# EAGLE design MicroVersion (EAGLE 6.5.0)
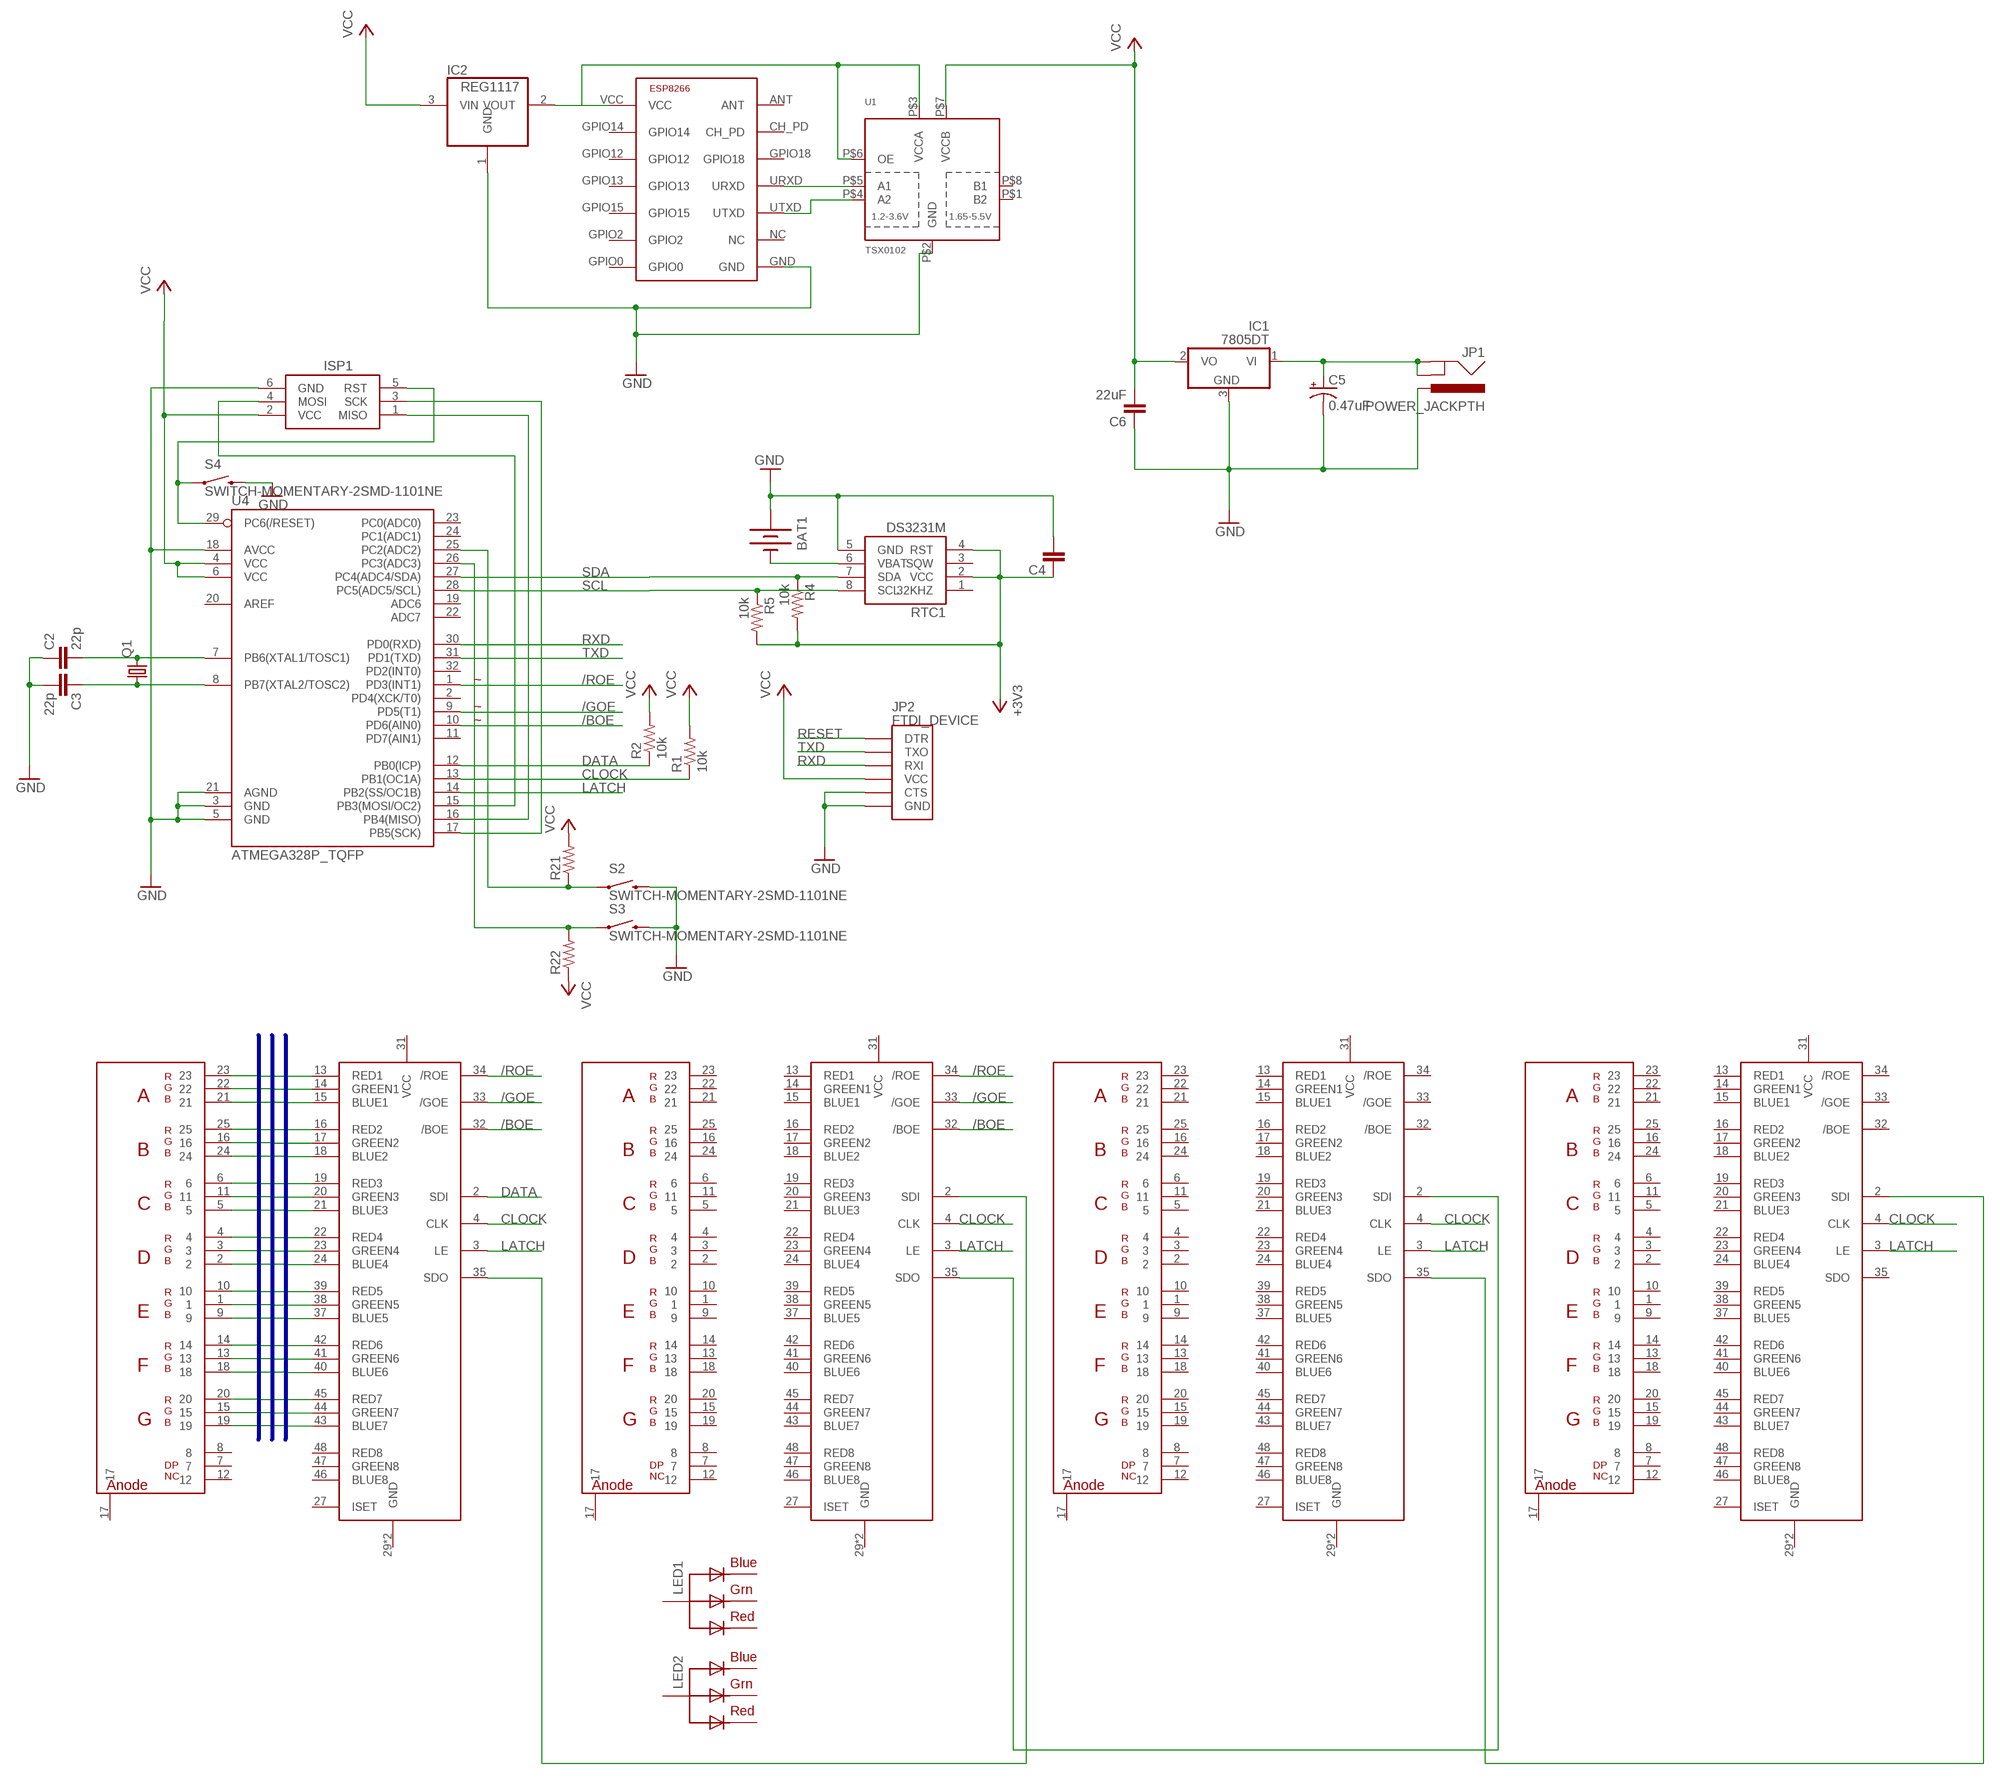
[diagram p0: schematic, sheet 1]

## Parts
BAT1  BATTERY12MM  [BATTCON_12MM]
C2  22p  CAP0805  [0805]
C3  22p  CAP0805  [0805]
C4  CAP0805  [0805]
C5  0.47uF  10UF-16V-10%(TANT)  [EIA3216]
C6  22uF  22UF-16V-20%-(1210)  [1210]
IC1  7805DT  [TO252]
IC2  REG1117  [SOT223]
ISP1  AVRISP-6  [AVRISP]
JP1  POWER_JACKPTH  [POWER_JACK_PTH]
JP2  FTDI_DEVICE  [FTDI_DEVICE_SIDE]
LED1  RGBLED_CA-5MM  [LED5MMRGB]
LED2  RGBLED_CA-5MM  [LED5MMRGB]
Q1  CRYSTALCTS406  [CTS406]
R1  10k  RESISTOR0805-RES  [0805]
R2  10k  RESISTOR0805-RES  [0805]
R4  10k  RESISTOR0805-RES  [0805]
R5  10k  RESISTOR0805-RES  [0805]
R21  RESISTOR0805-RES  [0805]
R22  RESISTOR0805-RES  [0805]
RTC1  DS3231M  [SOIC8]
S2  SWITCH-MOMENTARY-2SMD-1101NE  [TACTILE-SWITCH-1101NE]
S3  SWITCH-MOMENTARY-2SMD-1101NE  [TACTILE-SWITCH-1101NE]
S4  SWITCH-MOMENTARY-2SMD-1101NE  [TACTILE-SWITCH-1101NE]
U1  TSX0102  TXS0102  [VFSOP-8]
U4  ATMEGA328P_TQFP  [TQFP32-08]
U$1  RGBSEVENSEGMENT  [RGBSEVENSEGMENT]
U$2  RGBSEVENSEGMENT  [RGBSEVENSEGMENT]
U$3  RGBSEVENSEGMENT  [RGBSEVENSEGMENT]
U$4  RGBSEVENSEGMENT  [RGBSEVENSEGMENT]
U$5  LED2472G  [TQFP48]
U$6  LED2472G  [TQFP48]
U$7  LED2472G  [TQFP48]
U$8  LED2472G  [TQFP48]
U$10  ESP8266-03  [ESP-03]

## Nets
1BLUE1: U$1.24 U$5.15(BLUE1)
1BLUE2: U$1.21 U$5.18(BLUE2)
1BLUE3: U$1.19 U$5.21(BLUE3)
1BLUE4: U$1.18 U$5.24(BLUE4)
1BLUE5: U$1.9 U$5.37(BLUE5)
1BLUE6: U$1.2 U$5.40(BLUE6)
1BLUE7: U$1.5 U$5.43(BLUE7)
1GREEN1: U$1.16 U$5.14(GREEN1)
1GREEN2: U$1.22 U$5.17(GREEN2)
1GREEN3: U$1.15 U$5.20(GREEN3)
1GREEN4: U$1.13 U$5.23(GREEN4)
1GREEN5: U$1.1 U$5.38(GREEN5)
1GREEN6: U$1.3 U$5.41(GREEN6)
1GREEN7: U$1.11 U$5.44(GREEN7)
1RED1: U$1.25 U$5.13(RED1)
1RED2: U$1.23 U$5.16(RED2)
1RED3: U$1.20 U$5.19(RED3)
1RED4: U$1.14 U$5.22(RED4)
1RED5: U$1.10 U$5.39(RED5)
1RED6: U$1.4 U$5.42(RED6)
1RED7: U$1.6 U$5.45(RED7)
/BOE: U4.10(PD6(AIN0)) U$5.32(/BOE) U$6.32(/BOE)
/GOE: U4.9(PD5(T1)) U$5.33(/GOE) U$6.33(/GOE)
/ROE: U4.1(PD3(INT1)) U$5.34(/ROE) U$6.34(/ROE)
CLOCK: R1.1 U4.13(PB1(OC1A)) U$5.4(CLK) U$6.4(CLK) U$7.4(CLK) U$8.4(CLK)
DATA: R2.1 U4.12(PB0(ICP)) U$5.2(SDI)
GND: BAT1.PWR@1(+) C2.1 C3.2 C4.2 C5.C(-) C6.1 IC1.3(GND) IC2.1(GND) ISP1.6(GND) JP1.PWR JP2.P$5(CTS) JP2.P$6(GND) RTC1.5(GND) S2.2 S3.2 S4.2 U1.P$2(GND) U4.3(GND) U4.5(GND) U4.18(AVCC) U4.21(AGND) U$10.GND
LATCH: U4.14(PB2(SS/OC1B)) U$5.3(LE) U$6.3(LE) U$7.3(LE) U$8.3(LE)
MISO: ISP1.1(MISO) U4.16(PB4(MISO))
MOSI: ISP1.4(MOSI) U4.15(PB3(MOSI/OC2))
N$1: BAT1.GND(-) RTC1.6(VBAT)
N$2: U$5.35(SDO) U$6.2(SDI)
N$3: U$6.35(SDO) U$7.2(SDI)
N$4: U$7.35(SDO) U$8.2(SDI)
N$5: C5.A(+) IC1.1(VI) JP1.GND JP1.GNDBREAK
N$7: R22.2 S3.1 U4.26(PC3(ADC3))
N$8: R21.1 S2.1 U4.25(PC2(ADC2))
N$9: IC2.2(VOUT) U1.P$3(VCCA) U1.P$6(OE) U$10.VCC
N$11: U1.P$5(A1) U$10.URXD
N$12: U1.P$4(A2) U$10.UTXD
RESET: ISP1.5(RST) JP2.P$1(DTR) S4.1 U4.29(PC6(/RESET))
RXD: JP2.P$3(RXI) U4.30(PD0(RXD))
SCK: ISP1.3(SCK) U4.17(PB5(SCK))
SCL: R5.1 RTC1.8(SCL) U4.28(PC5(ADC5/SCL))
SDA: R4.1 RTC1.7(SDA) U4.27(PC4(ADC4/SDA))
TXD: JP2.P$2(TXO) U4.31(PD1(TXD))
VCC: C4.1 C6.2 IC1.2(VO) IC2.3(VIN) ISP1.2(VCC) JP2.P$4(VCC) R1.2 R2.2 R4.2 R5.2 R21.2 R22.1 RTC1.2(VCC) RTC1.4(RST) U1.P$7(VCCB) U4.4(VCC) U4.6(VCC) ; supply symbol labelled +3V3
XTAL1: C2.2 Q1.3 U4.7(PB6(XTAL1/TOSC1))
XTAL2: C3.1 Q1.1 U4.8(PB7(XTAL2/TOSC2))
Unconnected: LED1.1(RED) LED1.2(VCC) LED1.3(GREEN) LED1.4(BLUE) LED2.1(RED) LED2.2(VCC) LED2.3(GREEN) LED2.4(BLUE) RTC1.1(32KHZ) RTC1.3(SQW) U1.P$1(B2) U1.P$8(B1) U4.2(PD4(XCK/T0)) U4.11(PD7(AIN1)) U4.19(ADC6) U4.20(AREF) U4.22(ADC7) U4.23(PC0(ADC0)) U4.24(PC1(ADC1)) U4.32(PD2(INT0)) U$1.7 U$1.8 U$1.12 U$1.17 U$2.1 U$2.2 U$2.3 U$2.4 U$2.5 U$2.6 U$2.7 U$2.8 U$2.9 U$2.10 U$2.11 U$2.12 U$2.13 U$2.14 U$2.15 U$2.16 U$2.17 U$2.18 U$2.19 U$2.20 U$2.21 U$2.22 U$2.23 U$2.24 U$2.25 U$3.1 U$3.2 U$3.3 U$3.4 U$3.5 U$3.6 U$3.7 U$3.8 U$3.9 U$3.10 U$3.11 U$3.12 U$3.13 U$3.14 U$3.15 U$3.16 U$3.17 U$3.18 U$3.19 U$3.20 U$3.21 U$3.22 U$3.23 U$3.24 U$3.25 U$4.1 U$4.2 U$4.3 U$4.4 U$4.5 U$4.6 U$4.7 U$4.8 U$4.9 U$4.10 U$4.11 U$4.12 U$4.13 U$4.14 U$4.15 U$4.16 U$4.17 U$4.18 U$4.19 U$4.20 U$4.21 U$4.22 U$4.23 U$4.24 U$4.25 U$5.27(ISET) U$5.29(GND) U$5.30(GND) U$5.31(VCC) U$5.46(BLUE8) U$5.47(GREEN8) U$5.48(RED8) U$6.13(RED1) U$6.14(GREEN1) U$6.15(BLUE1) U$6.16(RED2) U$6.17(GREEN2) U$6.18(BLUE2) U$6.19(RED3) U$6.20(GREEN3) U$6.21(BLUE3) U$6.22(RED4) U$6.23(GREEN4) U$6.24(BLUE4) U$6.27(ISET) U$6.29(GND) U$6.30(GND) U$6.31(VCC) U$6.37(BLUE5) U$6.38(GREEN5) U$6.39(RED5) U$6.40(BLUE6) U$6.41(GREEN6) U$6.42(RED6) U$6.43(BLUE7) U$6.44(GREEN7) U$6.45(RED7) U$6.46(BLUE8) U$6.47(GREEN8) U$6.48(RED8) U$7.13(RED1) U$7.14(GREEN1) U$7.15(BLUE1) U$7.16(RED2) U$7.17(GREEN2) U$7.18(BLUE2) U$7.19(RED3) U$7.20(GREEN3) U$7.21(BLUE3) U$7.22(RED4) U$7.23(GREEN4) U$7.24(BLUE4) U$7.27(ISET) U$7.29(GND) U$7.30(GND) U$7.31(VCC) U$7.32(/BOE) U$7.33(/GOE) U$7.34(/ROE) U$7.37(BLUE5) U$7.38(GREEN5) U$7.39(RED5) U$7.40(BLUE6) U$7.41(GREEN6) U$7.42(RED6) U$7.43(BLUE7) U$7.44(GREEN7) U$7.45(RED7) U$7.46(BLUE8) U$7.47(GREEN8) U$7.48(RED8) U$8.13(RED1) U$8.14(GREEN1) U$8.15(BLUE1) U$8.16(RED2) U$8.17(GREEN2) U$8.18(BLUE2) U$8.19(RED3) U$8.20(GREEN3) U$8.21(BLUE3) U$8.22(RED4) U$8.23(GREEN4) U$8.24(BLUE4) U$8.27(ISET) U$8.29(GND) U$8.30(GND) U$8.31(VCC) U$8.32(/BOE) U$8.33(/GOE) U$8.34(/ROE) U$8.35(SDO) U$8.37(BLUE5) U$8.38(GREEN5) U$8.39(RED5) U$8.40(BLUE6) U$8.41(GREEN6) U$8.42(RED6) U$8.43(BLUE7) U$8.44(GREEN7) U$8.45(RED7) U$8.46(BLUE8) U$8.47(GREEN8) U$8.48(RED8) U$10.ANT U$10.CH_PD U$10.GPIO0 U$10.GPIO2 U$10.GPIO12 U$10.GPIO13 U$10.GPIO14 U$10.GPIO15 U$10.GPIO18 U$10.NC

## Buses
1RED[1..7]
1GREEN[1..7]
1BLUE[1..7]

## Notes on the sheet
- ~
- ~
- ~

## Library data of the parts
BAT1 = SparkFun-Electromechanical:BATTERY: Battery Holders Various common sizes : AA, AAA, 18650 (PRT-12895), 20mm coin cell and 12mm coin cell. 20MM_4LEGS, BATT-10373; PROD_ID: BATT-08044
C2-C4 = SparkFun-Passives:CAP: Capacitor Standard 0603 ceramic capacitor, and 0.1" leaded capacitor.
C5 = SparkFun-Capacitors:10UF-16V-10%(TANT): CAP-00811 1206/EIA-3216 Tantalum capacitor; PROD_ID: CAP-00811; VALUE: 10uF
C6 = SparkFun-Capacitors:22UF-16V-20%-(1210): CAP-10381; PROD_ID: CAP-10381
IC1 = linear:78*: Positive VOLTAGE REGULATOR Source: http://cache.national.com/ds/LM/LM78L05.pdf http://www.fairchildsemi.com/ds/LM/LM7805.pdf
IC2 = burr-brown:REG1117: 800mA and 1A Low Dropout (LDO) Positive Regulator 1.8V, 2.5V, 2.85V, 3.3V, 5V, and Adj; MPN: REG1117; OC_FARNELL: 1097566; OC_NEWARK: 14P6981
ISP1 = adafruit:AVRISP: AVR ISP HEADER Standard 6 pin header for AVR programming
JP1 = SparkFun-Connectors:POWER_JACK: Power Jack This is the standard 5.5mm barrel jack for power. The PTH is the most common, proven, reliable, footprint. The Slot footprint only works if the mill layer is transmitted to the PCB fab house so be warned. Mating wall wart : TOL-00298 (and others); PROD_ID: CONN-08197
JP2 = SparkFun-Connectors:FTDI_DEVICE: Connector which mates to FTDI basic or FTDI cable.
LED1 LED2 = adafruit:RGBLED_CA: RGB LED, common-anode 5MM Staggered pins 5mm Piranha package http://www.ladyada.net/library/pcb/eaglelibrary.html
Q1 = adafruit:CRYSTAL: CRYSTAL; OC_FARNELL: unknown; OC_NEWARK: unknown
R1 R2 R4 R5 R21 R22 = SparkFun-Passives:RESISTOR: Resistor Basic schematic elements and footprints for 0603, 1206, and PTH resistors.
RTC1 = SparkFun-DigitalIC:DS3231M: DS3231M Real Time Clock. Accuracy +/-5ppm. Battery Backup. 2.3V to 5.5V.; PROD_ID: IC-11985
S2-S4 = SparkFun-Electromechanical:SWITCH-MOMENTARY-2: Various NO switches- pushbuttons, reed, etc; PROD_ID: SWCH-00815
U1 = adafruit:TXS0102: 2-Bit Bi-Directional Level Shifter (I2C, etc.) Designed for I2C devices and has internal pullups. Not to be confused with TXB010x series. 1.2V-3.6V (VCCA) to 1.65V-5.5V (VCCB) bi-directional level shifter with auto direction sensing. Max data rate - 24Mbps (Push Pull), 2Mbps (Open Drain) Digikey: 296-21931-1-ND
U4 = SparkFun-DigitalIC:ATMEGA328P_TQFP; PROD_ID: IC-09069
U$1-U$4 = Benchoff:RGBSEVENSEGMENT
U$5-U$8 = Benchoff:LED2472G
U$10 = #ESP8266:ESP8266-03: ESP8266 - ESP-03 Module

## Board
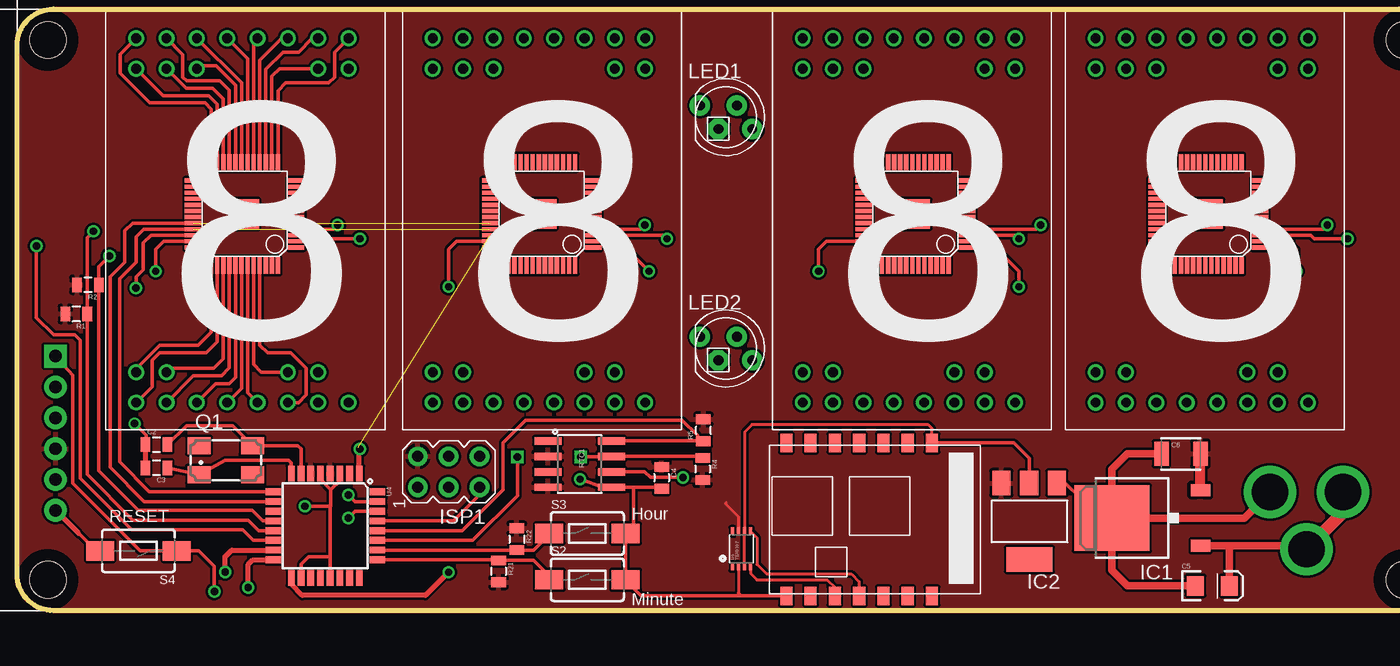
[diagram p1: board, top side]
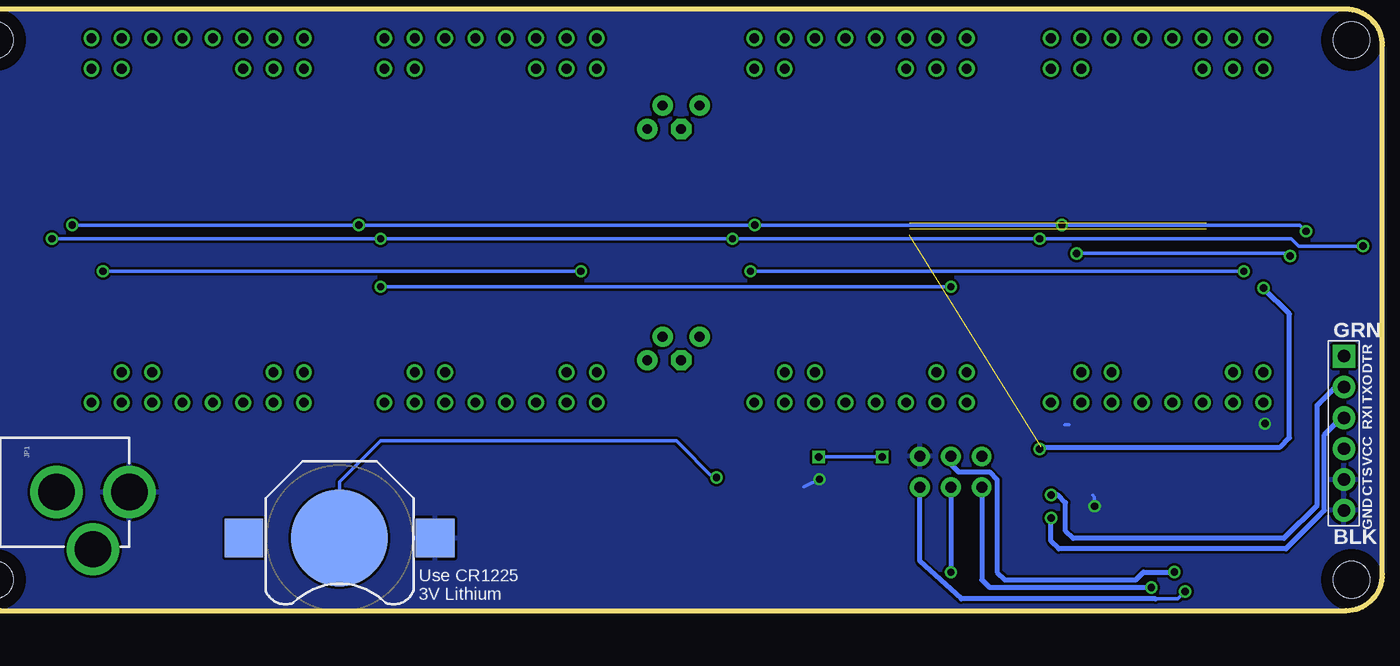
[diagram p2: board, bottom side, seen from below]

No outline drawn. Coordinates in mm, seen from the top.
Copper layers (1*16): Top 0.035mm / dielectric 1.5mm / Bottom 0.035mm
Design rules "default": minimum track width 10mil, minimum drill 24mil, track to track 8mil, track to pad 8mil, pad to pad 8mil, via to via 8mil, smd to smd 8mil, copper to edge 40mil, drill to drill 8mil, minimum pad ring 10mil, minimum via ring 8mil, stop-mask expansion 4mil, vias tented up to drill 0mil, thermal gap 10mil
Holes 3 mm at 36.83,10.16 148.59,10.16 36.83,54.61 148.59,54.61
tRestrict: area 130.8,16.9 to 132.7,19.4
Milling: 8 lines

### Footprints (pad centres in the part's own frame; a part is rotated, then mirrored left to right if it is on the bottom)
BATTCON_12MM = smd 8 x 8: GND 0,0 | smd 3.175 x 3.175: PWR@1 -7.874,0; PWR@2 7.874,0
0805 = smd 0.8 x 1.2: 1 -0.9,0; 2 0.9,0
EIA3216 = smd 1.4 x 1.6: A 1.4,0; C -1.4,0
1210 = smd 1.2 x 2: 1 -1.6,0; 2 1.6,0
TO252 = smd 1 x 1.6: 1 -2.28,-4.8; 2 2.28,-4.8 | smd 5.4 x 6.2: 3 0,2.5
SOT223 = smd 1.499 x 2.007: 1 -2.261,-3.15; 2 0.025,-3.15; 3 2.311,-3.15 | smd 3.81 x 2.007: 4 0,3.15
AVRISP = drill 0.9 pad 1.626: 1 -1.27,2.54; 2 1.27,2.54; 3 -1.27,0; 4 1.27,0; 5 -1.27,-2.54; 6 1.27,-2.54
POWER_JACK_PTH = drill 2.997 pad 4.318: GND 0,7.7; GNDBREAK 4.7,10.7; PWR 0,13.7
FTDI_DEVICE_SIDE = drill 1.016 pad 1.88 square: P$1 -6.35,0 | drill 1.016 pad 1.88: P$2 -3.81,0; P$3 -1.27,0; P$4 1.27,0; P$5 3.81,0; P$6 6.35,0
LED5MMRGB = drill 0.8 pad 1.676: 1 -2.159,0.968; 3 0.889,0.968; 4 2.159,-0.968 | drill 0.8 pad 1.676 octagon: 2 -0.635,-0.968
CTS406 = smd 1.9 x 1.4: 1 -2.2,-1.2; 2 2.2,-1.2; 3 2.2,1.2; 4 -2.2,1.2
SOIC8 = smd 0.61 x 2.21: 1 -1.905,-2.616; 2 -0.635,-2.616; 3 0.635,-2.616; 4 1.905,-2.616; 5 1.905,2.616; 6 0.635,2.616; 7 -0.635,2.616; 8 -1.905,2.616
TACTILE-SWITCH-1101NE = smd 2.3 x 1.6: 1 -3.15,0; 2 3.15,0
VFSOP-8 = smd 0.25 x 0.65: P$1 -0.75,-1.45; P$2 -0.25,-1.45; P$3 0.25,-1.45; P$4 0.75,-1.45; P$5 0.75,1.45; P$6 0.25,1.45; P$7 -0.25,1.45; P$8 -0.75,1.45
TQFP32-08 = smd 1.27 x 0.559: 1 -4.293,2.8; 2 -4.293,2; 3 -4.293,1.2; 4 -4.293,0.4; 5 -4.293,-0.4; 6 -4.293,-1.2; 7 -4.293,-2; 8 -4.293,-2.8; 17 4.293,-2.8; 18 4.293,-2; 19 4.293,-1.2; 20 4.293,-0.4; 21 4.293,0.4; 22 4.293,1.2; 23 4.293,2; 24 4.293,2.8 | smd 0.559 x 1.27: 9 -2.8,-4.293; 10 -2,-4.293; 11 -1.2,-4.293; 12 -0.4,-4.293; 13 0.4,-4.293; 14 1.2,-4.293; 15 2,-4.293; 16 2.8,-4.293; 25 2.8,4.293; 26 2,4.293; 27 1.2,4.293; 28 0.4,4.293; 29 -0.4,4.293; 30 -1.2,4.293; 31 -2,4.293; 32 -2.8,4.293
RGBSEVENSEGMENT = drill 0.8: 1 2.5,2.25; 2 5,2.25; 3 7.5,2.25; 4 10,2.25; 5 12.5,2.25; 6 15,2.25; 7 17.5,2.25; 8 20,2.25; 9 2.5,4.75; 10 5,4.75; 11 15,4.75; 12 17.5,4.75; 13 2.5,29.75; 14 5,29.75; 15 7.5,29.75; 16 17.5,29.75; 17 20,29.75; 18 2.5,32.25; 19 5,32.25; 20 7.5,32.25; 21 10,32.25; 22 12.5,32.25; 23 15,32.25; 24 17.5,32.25; 25 20,32.25
TQFP48 = smd 0.35 x 1.35: 1 -2.75,-4.25; 2 -2.25,-4.25; 3 -1.75,-4.25; 4 -1.25,-4.25; 5 -0.75,-4.25; 6 -0.25,-4.25; 7 0.25,-4.25; 8 0.75,-4.25; 9 1.25,-4.25; 10 1.75,-4.25; 11 2.25,-4.25; 12 2.75,-4.25; 25 2.75,4.25; 26 2.25,4.25; 27 1.75,4.25; 28 1.25,4.25; 29 0.75,4.25; 30 0.25,4.25; 31 -0.25,4.25; 32 -0.75,4.25; 33 -1.25,4.25; 34 -1.75,4.25; 35 -2.25,4.25; 36 -2.75,4.25 | smd 1.35 x 0.35: 13 4.25,-2.75; 14 4.25,-2.25; 15 4.25,-1.75; 16 4.25,-1.25; 17 4.25,-0.75; 18 4.25,-0.25; 19 4.25,0.25; 20 4.25,0.75; 21 4.25,1.25; 22 4.25,1.75; 23 4.25,2.25; 24 4.25,2.75; 37 -4.25,2.75; 38 -4.25,2.25; 39 -4.25,1.75; 40 -4.25,1.25; 41 -4.25,0.75; 42 -4.25,0.25; 43 -4.25,-0.25; 44 -4.25,-0.75; 45 -4.25,-1.25; 46 -4.25,-1.75; 47 -4.25,-2.25; 48 -4.25,-2.75 | smd 2.4 x 2.4: PAD 0,0
ESP-03 = smd 1 x 1.5: ANT 4,12.4; CH_PD 6,12.4; GND 16,12.4; GPIO0 16,-0.2; GPIO2 14,-0.2; GPIO12 8,-0.2; GPIO13 10,-0.2; GPIO14 6,-0.2; GPIO15 12,-0.2; GPIO18 8,12.4; NC 14,12.4; URXD 10,12.4; UTXD 12,12.4; VCC 4,-0.2

### Placement (x,y rotation side)
BAT1  120.22,13.59 180 bottom
C2  45.77,21.29 0 top
C3  45.77,19.38 180 top
C4  87.4,18.56 270 top
C5  132.78,9.65 0 top
C6  130.19,20.53 0 top
IC1  127,15.24 90 top
IC2  117.71,14.98 180 top
ISP1  69.85,19.05 90 top
JP1  151.23,17.37 270 bottom
JP2  37.47,22.23 270 bottom
LED1  92.71,48.26 0 top
LED2  92.71,29.21 0 top
Q1  51.49,20.02 0 top
R1  39.17,32.05 180 top
R2  40.13,34.45 180 top
R4  90.77,19.28 270 top
R5  90.84,22.48 90 top
R21  73.96,10.86 270 top
R22  75.46,13.5 270 top
RTC1  80.64,19.68 270 top
S2  81.28,10.16 0 top
S3  81.28,13.97 0 top
S4  44.29,12.54 180 top
U1  93.98,12.7 0 top
U4  59.69,14.61 270 top
U$1  41.61,22.5 0 top
U$2  66.04,22.5 0 top
U$3  96.52,22.5 0 top
U$4  120.66,22.5 0 top
U$5  53.04,40.28 90 top
U$6  77.52,40.28 90 top
U$7  108.31,40.28 90 top
U$8  132.44,40.28 90 top
U$10  113.67,21.22 180 top

### Tracks (layer width: path | path; a pad name or v marks a point on that pad's centre or on a via)
1BLUE1
  Top 0.305: U$5.15 54.78,52.19 56.21,53.62 57.48,53.62 58.62,54.75 U$1.24
1BLUE2
  Top 0.305: U$5.18 53.28,53.07 U$1.21
1BLUE3
  Top 0.305: U$5.21 51.78,50.48 51,51.26 48.26,51.26 47.95,51.56 47.95,53.4 U$1.19
1BLUE4
  Top 0.305: U$5.24 50.28,48.93 49.78,49.43 45.21,49.43 42.77,51.87 42.77,53.42 U$1.18
1BLUE5
  Top 0.305: U$5.37 50.28,30.55 49.23,29.49 46.05,29.49 44.1,27.54 U$1.9
1BLUE6
  Top 0.305: U$5.40 51.78,27.6 51.13,26.95 48.8,26.95 U$1.2
1BLUE7
  Top 0.305: U$5.43 53.28,25.57 U$1.5
1GREEN1
  Top 0.305: U$5.14 55.28,51.62 55.92,52.25 U$1.16
1GREEN2
  Top 0.305: U$5.17 53.78,54.43 U$1.22
1GREEN3
  Top 0.305: U$5.20 52.28,50.89 50.7,52.48 49.33,52.48 U$1.15
1GREEN4
  Top 0.305: U$5.23 50.78,49.34 50.09,50.04 46.32,50.04 U$1.13
1GREEN5
  Top 0.305: U$5.38 50.78,29.78 49.86,28.85 46.05,28.85 45.41,28.22 45.41,26.06 U$1.1
1GREEN6
  Top 0.305: U$5.41 52.28,26.83 51.77,26.31 50.66,26.31 U$1.3
1GREEN7
  Top 0.305: U$5.44 53.78,27.89 54.42,27.25 U$1.11
1RED1
  Top 0.305: U$5.13 55.78,50.44 56.42,51.08 59.97,51.08 60.45,51.56 60.45,53.6 U$1.25
1RED2
  Top 0.305: U$5.16 54.28,52.96 56.08,54.75 U$1.23
1RED3
  Top 0.305: U$5.19 52.78,51.07 U$1.20
1RED4
  Top 0.305: U$5.22 51.28,49.76 50.39,50.65 48.21,50.65 U$1.14
1RED5
  Top 0.305: U$5.39 51.28,28.37 50.49,27.58 46.94,27.58 U$1.10
1RED6
  Top 0.305: U$5.42 52.78,25.93 U$1.4
1RED7
  Top 0.305: U$5.45 54.28,29.49 54.92,28.85 56.84,28.85 58.12,27.58 58.12,25.39 57.48,24.75 U$1.6
/BOE  (1 unrouted)
  Top 0.305: U$5.32 43.81,39.53 43.18,38.9 43.18,36.32 41.96,35.1 41.96,19.43 44.78,16.61 U4.10
/GOE  (1 unrouted)
  Top 0.305: U$5.33 44.73,39.03 44.09,38.4 44.09,36.32 42.73,34.96 42.73,19.88 45.2,17.41 U4.9
/ROE  (via drill 0.6)  (1 unrouted)
  Top 0.305: v44.09,34.19 44.09,35.1 44.7,35.71 44.7,37.9 45.34,38.53 U$5.34
  Top 0.406: U4.1 62.49,20.78 v62.53,20.93
  Bottom 0.406: v62.53,20.93 62.38,21.08 42.72,21.08 41.96,21.84 41.96,32.05 v44.09,34.19
CLOCK  (via drill 0.6)
  Top 0.305: v142.24,39.37 141.9,39.03 U$8.4 | U$7.4 118.28,39.03 v118.62,39.37 | U$6.4 85.67,39.03 v86,39.37 | U$5.4 60.37,39.03 v60.71,39.37 | v40.59,38.86 40.07,38.35 R1.1 40.07,18.84 43.83,15.08 53.34,15.08 54.22,14.21 U4.13
  Bottom 0.305: v40.59,38.86 41.1,39.37 v60.71,39.37 v86,39.37 v118.62,39.37 v142.24,39.37
DATA  (via drill 0.6)
  Top 0.305: v59.49,37.03 58.49,38.03 U$5.2 | v41.91,36.83 41.03,35.95 R2.1 41.03,19.13 44.29,15.88 53.66,15.88 54.53,15.01 U4.12 55.31,14.92
  Bottom 0.305: 42.11,37.03 v59.49,37.03
  Bottom 0.406: v41.91,36.83 42.11,37.03
GND  (via drill 0.6)
  Top 0.254: U1.P$2 93.73,9.07 93.98,8.82
  Top 0.305: U4.3 60.89,18.32 60.15,17.58 | 60.15,17.58 60.15,16.2 | 60.15,16.2 v58.01,16.2 | 85.09,17.78 RTC1.5 82.6,17.78 v80.67,18.44 | C3.2 44.93,19.44 44.93,22.07 v43.97,23.02 | 60.15,17.58 59.29,18.43 U4.5 | 60.15,16.2 60.09,16.15 60.09,12.06 | 60.09,12.06 U4.21 | U4.18 57.69,11.43 58.33,12.06 60.09,12.06 | 39.37,13.97 40.8,12.54 S4.2 | 85.09,17.78 85.09,14.63 S3.2 S2.2 84.43,10.09 85.7,8.82 93.98,8.82 U$10.GND | 85.09,17.78 87.28,17.78 C4.2 | IC2.1 120.65,18.13 121.92,16.86 121.92,15.24 123.19,15.24
  Top 0.406: C3.2 C2.1 | 39.37,13.97 JP2.P$6
  Top 0.61: JP1.PWR 135.4,15.24 IC1.3 | 123.19,15.24 IC1.3 | C6.1 125.77,20.53 124.5,19.26 IC1.3 | C5.C 125.77,9.65 124.5,10.93 IC1.3
  Bottom 0.305: 60.15,22.91 60.45,22.91 | v58.01,16.2 58.01,16.97 58.17,17.12 | v80.67,18.44 81.94,17.83 | v43.97,23.02 43.81,22.86
  pour Bottom: 34.29,54.15 34.29,10.62 arc90 37.29,7.62 148.13,7.62 arc90 151.13,10.62 151.13,54.15 arc90 148.13,57.15 37.29,57.15 arc90
LATCH  (via drill 0.6)
  Top 0.305: v143.92,38.25 141.17,38.25 140.89,38.53 U$8.3 | U$7.3 116.56,38.53 v116.84,38.25 | U$6.3 87.55,38.53 v87.83,38.25 | U$5.3 59.2,38.53 59.49,38.25 v62.53,38.25 | v35.89,37.64 35.88,37.63 35.88,31.75 37.31,30.32 39.05,30.32 39.5,29.87 39.5,18.53 43.74,14.29 52.86,14.29 53.75,13.4 U4.14
  Bottom 0.305: v35.89,37.64 41.2,37.64 41.81,38.25 v62.53,38.25 v87.83,38.25 v116.84,38.25 v143.92,38.25
MISO  (via drill 0.6)
  Top 0.406: v53.34,9.53 53.34,11.43 53.72,11.8 U4.16
  Bottom 0.406: ISP1.1 67.31,10.16 66.67,9.53 v53.34,9.53
MOSI  (via drill 0.6)
  Top 0.406: v51.44,10.79 51.44,12.06 51.98,12.61 U4.15
  Bottom 0.406: v51.44,10.79 53.98,10.79 54.61,10.16 65.41,10.16 66.04,10.79 66.04,18.41 66.67,19.05 69.22,19.05 69.85,19.68 ISP1.4
N$1  (via drill 0.6)
  Top 0.305: RTC1.6 86,19.05 86.47,18.59 v89.16,18.59
  Bottom 0.305: v89.16,18.59 89.31,18.43 92.47,21.59 116.84,21.59 120.22,18.21 BAT1.GND 118.79,13.59
N$2  (via drill 0.6)
  Top 0.305: U$5.35 46.35,38.03 45.72,37.4 v45.72,35.56 | v86.36,35.56 83.89,38.03 U$6.2
  Bottom 0.305: v45.72,35.56 v86.36,35.56
N$3  (via drill 0.6)
  Top 0.305: U$6.35 70.48,38.03 69.85,37.4 v69.85,34.29 | v116.84,34.29 116.84,35.56 114.37,38.03 U$7.2
  Bottom 0.305: v69.85,34.29 v116.84,34.29
N$4  (via drill 0.6)
  Top 0.305: U$7.35 100.97,38.03 100.33,37.4 v100.33,35.56 | U$8.2 139.06,38.03 139.7,37.4 v139.7,35.56
  Bottom 0.305: v100.33,35.56 v139.7,35.56
N$5
  Top 0.61: JP1.GNDBREAK 140.25,12.96 134.18,12.96 | 134.18,12.96 IC1.1 | C5.A 134.18,12.96
  Top 1.016: JP1.GNDBREAK 143.53,15.67 JP1.GND
N$6
  Top 0.305: 41.12,34.45 41.27,34.29
N$7
  Top 0.305: U4.26 76.2,12.61 | 76.2,12.61 76.86,12.61 78.13,13.88 S3.1 | R22.2 76.2,12.6 76.2,12.61
N$8
  Top 0.305: 78.13,10.54 S2.1 78.13,10.49 76.86,11.76 R21.1 73.91,11.8 U4.25
N$9
  Top 0.254: U1.P$3 U1.P$6 94.23,22.32 94.84,22.93 109.36,22.93 109.67,22.63 U$10.VCC
  Top 0.305: U$10.VCC 116.41,21.42 117.68,20.15 IC2.2
N$11
  Top 0.254: U1.P$5 95.25,13.63 95.25,11.43 96.04,10.64 103.03,10.64 103.67,10 U$10.URXD
N$12
  Top 0.254: U1.P$4 94.73,10.68 95.25,10.16 101.03,10.16 101.67,9.53 U$10.UTXD
RESET  (via drill 0.6)
  Top 0.305: JP2.P$1 38.89,26.99 38.89,18.1 44.45,12.54 S4.1 49.28,12.54 50.55,11.27 v50.55,9.2 | U4.29 70.25,15.01 72.39,17.14 ISP1.5
  Bottom 0.305: 52.98,8.59 51.16,8.59 v50.55,9.2
  Bottom 0.406: 52.98,8.59 68.99,8.59 72.39,11.68 ISP1.5
RXD  (via drill 0.6)
  Top 0.305: U4.30 62.16,15.8 v61.59,15.24
  Bottom 0.406: JP2.P$3 37.67,23.5 39.06,22.1 39.06,15.88 42.24,12.7 60.96,12.7 61.59,13.34 v61.59,15.24
SCK  (via drill 0.6)
  Top 0.406: v69.85,10.77 67.94,8.87 57.78,8.87 56.9,9.8 U4.17
  Bottom 0.406: ISP1.3 v69.85,10.77
SCL
  Top 0.305: U4.28 70.95,14.21 74.32,17.58 74.32,21.44 76.2,23.32 89.07,23.32 90.34,22.05 90.34,21.59 | RTC1.8 90.34,21.59 | 90.34,21.59 90.83,21.59 R5.1
SDA  (via drill 0.6)
  Top 0.305: 83.19,20.32 RTC1.7 | U4.27 71.83,13.4 75.51,17.09 v75.51,20.27 | RTC1.7 90.63,20.32 R4.1 | v80.74,20.27 83.22,20.27 RTC1.7
  Bottom 0.305: v75.51,20.27 v80.74,20.27
TXD  (via drill 0.6)
  Top 0.305: U4.31 62.13,16.61 v61.59,17.14
  Top 0.406: 61.69,17.24 v61.59,17.14
  Bottom 0.406: JP2.P$2 38.18,26.04 39.67,24.54 39.67,16.31 42.42,13.56 59.79,13.56 60.4,14.17 60.4,16.51 61.04,17.14 v61.59,17.14
VCC
  Top 0.254: U1.P$7 93.77,14.19 93.77,15.33 92.71,16.38 92.71,16.51
  Top 0.813: IC1.2 131.78,17.54 C6.2
  pour Top: 37.29,7.62 148.13,7.62 arc90 151.13,10.62 151.13,54.15 arc90 148.13,57.15 37.29,57.15 arc90 34.29,54.15 34.29,10.62 arc90
XTAL1
  Top 0.305: U4.7 57.69,20.95 57.43,21.21 Q1.3 52.07,22.86 48.26,22.86 C2.2
XTAL2
  Top 0.305: C3.1 Q1.1 51.44,20 56.67,20 56.89,19.79 U4.8

### Text on the board
tPlace: RESET | Hour | Minute
bPlace: Use CR1225 / 3V Lithium